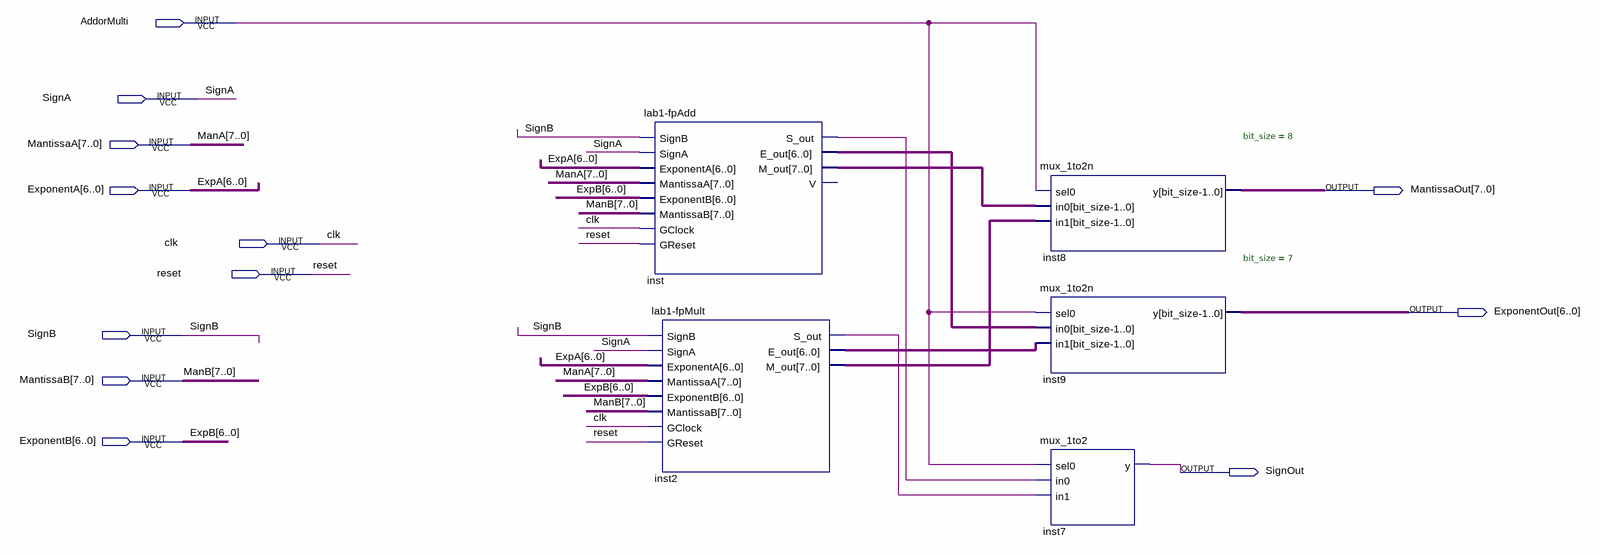
[diagram p0: schematic sheet]
// Quartus schematic FloatPointALU.bdf as structural Verilog: 5 symbols, 12 pins
module FloatPointALU (
  input  AddorMulti,
  input  SignA,
  input  [7:0] MantissaA,
  input  [6:0] ExponentA,
  input  clk,
  input  reset,
  input  SignB,
  input  [7:0] MantissaB,
  input  [6:0] ExponentB,
  output [7:0] MantissaOut,
  output [6:0] ExponentOut,
  output SignOut
);

  wire inst2_s_out, inst_s_out;
  wire [6:0] inst2_e_out, inst_e_out;
  wire [7:0] inst2_m_out, inst_m_out;

  \lab1-fpAdd  inst (
    .SignB(SignB), .SignA(SignA), .ExponentA(ExponentA), .MantissaA(MantissaA), .ExponentB(ExponentB),
    .MantissaB(MantissaB), .GClock(clk), .GReset(reset), .S_out(inst_s_out), .E_out(inst_e_out),
    .M_out(inst_m_out));  // open: V
  \lab1-fpMult  inst2 (
    .SignB(SignB), .SignA(SignA), .ExponentA(ExponentA), .MantissaA(MantissaA), .ExponentB(ExponentB),
    .MantissaB(MantissaB), .GClock(clk), .GReset(reset), .S_out(inst2_s_out), .E_out(inst2_e_out),
    .M_out(inst2_m_out));
  mux_1to2n #(.bit_size(8)) inst8 (.sel0(AddorMulti), .in0(inst_m_out), .in1(inst2_m_out), .y(MantissaOut));
  mux_1to2n #(.bit_size(7)) inst9 (.sel0(AddorMulti), .in0(inst_e_out), .in1(inst2_e_out), .y(ExponentOut));
  mux_1to2 inst7 (.sel0(AddorMulti), .in0(inst_s_out), .in1(inst2_s_out), .y(SignOut));

  // Other names for the same wires on the sheet: ExpA[6:0] = ExponentA; ExpB[6:0] = ExponentB; ManA[7:0] = MantissaA;
  //   ManB[7:0] = MantissaB
endmodule
